# Altium schematic sheet AMU-S20-V00-CURRENTLEMInterface.SchDoc: Current Sensor Interface
size A3; DrawnBy: Jonn Dillon; DocumentNumber: 6; SheetNumber: 18; SheetTotal: 25; Project: Shutdown Current Board 2020
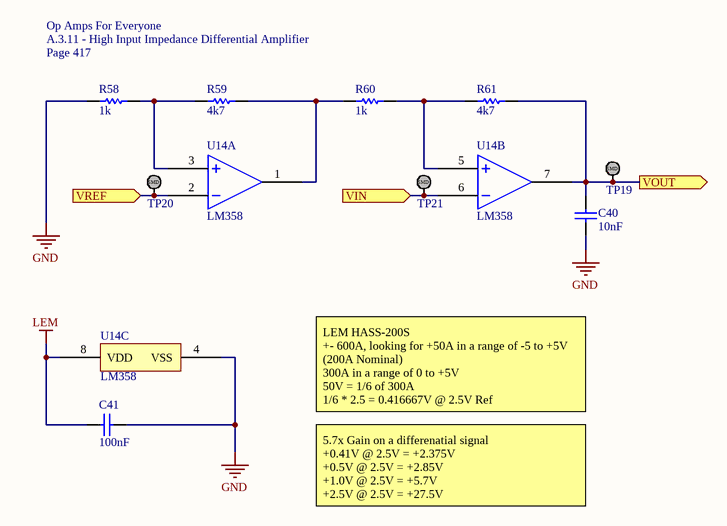
[diagram p0: AMU-S20-V00-CURRENTLEMInterface.SchDoc]

## Parts
C40  10nF  [Cap_Ceramic_0603]
C41  100nF  [Cap_Ceramic_0603]
R58  1k  [Res_ThinFilm_0603]
R59  4k7  [Res_ThinFilm_0603]
R60  1k  [Res_ThinFilm_0603]
R61  4k7  [Res_ThinFilm_0603]
TP19  TestPoint_SMD  [TestPointSMD]  (value not drawn)
TP20  TestPoint_SMD  [TestPointSMD]  (value not drawn)
TP21  TestPoint_SMD  [TestPointSMD]  (value not drawn)
U14  LM358  [TSSOP-8]  (parts A,B,C of 3)

## Ports
VIN (in), VOUT (out), VREF (in)

## Nets
GND: C40.1 C41.2 R58.1 U14.4(VSS)
LEM: C41.1 U14.8(VDD)
VIN: TP21.1 U14.6(IN2-) ; port VIN
VOUT: C40.2 R61.2 TP19.1 U14.7(OUT1) ; port VOUT
VREF: TP20.1 U14.2(IN1-) ; port VREF
NetR58_2: R58.2 R59.1 U14.3(IN1+)
NetR59_2: R59.2 R60.1 U14.1(OUT1)
NetR60_2: R60.2 R61.1 U14.5(IN2+)

## Notes on the sheet
- Op Amps For Everyone
- A.3.11 - High Input Impedance Differential Amplifier
- (near R58) Page 417
- LEM HASS-200S
  +- 600A, looking for +50A in a range of -5 to +5V
  (200A Nominal)
  300A in a range of 0 to +5V
  50V = 1/6 of 300A
  1/6 * 2.5 = 0.416667V @ 2.5V Ref
- 5.7x Gain on a differenatial signal
  +0.41V @ 2.5V = +2.375V
  +0.5V @ 2.5V = +2.85V
  +1.0V @ 2.5V = +5.7V
  +2.5V @ 2.5V = +27.5V
- Revision History:
- Sheet Title:
- Rev
- Date
- Description
- Project:
- Size:
- Drawn By:
- A3
- Number:
- Revision:
- Sheet
- Version:
- of
- QUT Motorsport
- O-120, Gardens Point
- 2 George Street
- Brisbane, QLD 4000
- Australia
- Print Date:
- Print Time:
- File Name:
- (in symbol TestPoint_SMD) SMD

## Library data of the parts
C40 = 10nF 50V 5% X7R 0603: Capacitor, Ceramic, SMD, 10nF, 50V, 5%, X7R, 0603
C41 = 100nF 50V 5% X7R 0603: Capacitor, Ceramic, SMD, 100nF, 50V, 5%, X7R, 0603
R58 R60 = 1k 5% 0603: Resistor, SMD, 1k, 0.1W, 5%, 0603
R59 R61 = 4k7 5% 0603: Resistor, SMD, 4k7, 0.1W, 5%, 0603
U14 = LM358: General Purpose Amplifier 2 Circuit 8-SOIC